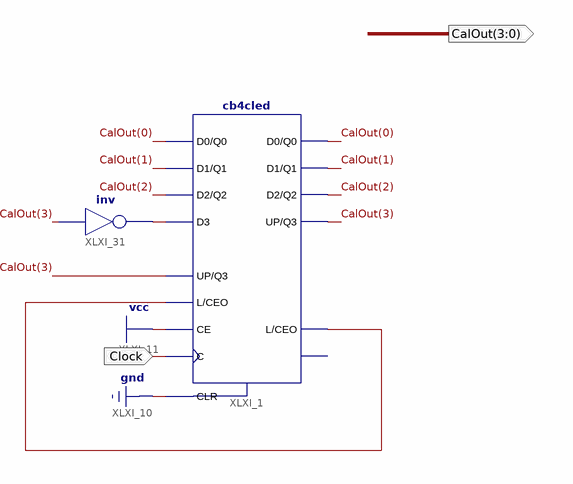
[diagram p0: schematic sheet 1]
// Xilinx ISE schematic dwe5.sch (spartan3) as structural Verilog: 2 symbols, 2 ports
module dwe5 (
  input  Clock,
  output [3:0] CalOut
);

  wire XLXN_11, XLXN_70;

  cb4cled XLXI_1 (
    .C(Clock), .CE(1'b1), .CLR(1'b0), .D0(CalOut[0]), .D1(CalOut[1]), .D2(CalOut[2]), .D3(XLXN_11),
    .L(XLXN_70), .UP(CalOut[3]), .CEO(XLXN_70), .Q0(CalOut[0]), .Q1(CalOut[1]), .Q2(CalOut[2]), .Q3(CalOut[3]));  // open: TC
  not XLXI_31 (XLXN_11, CalOut[3]);
endmodule
